# EasyEDA Pro project Bussiness_Card_Easyeda.epro

# Schematic Business Card
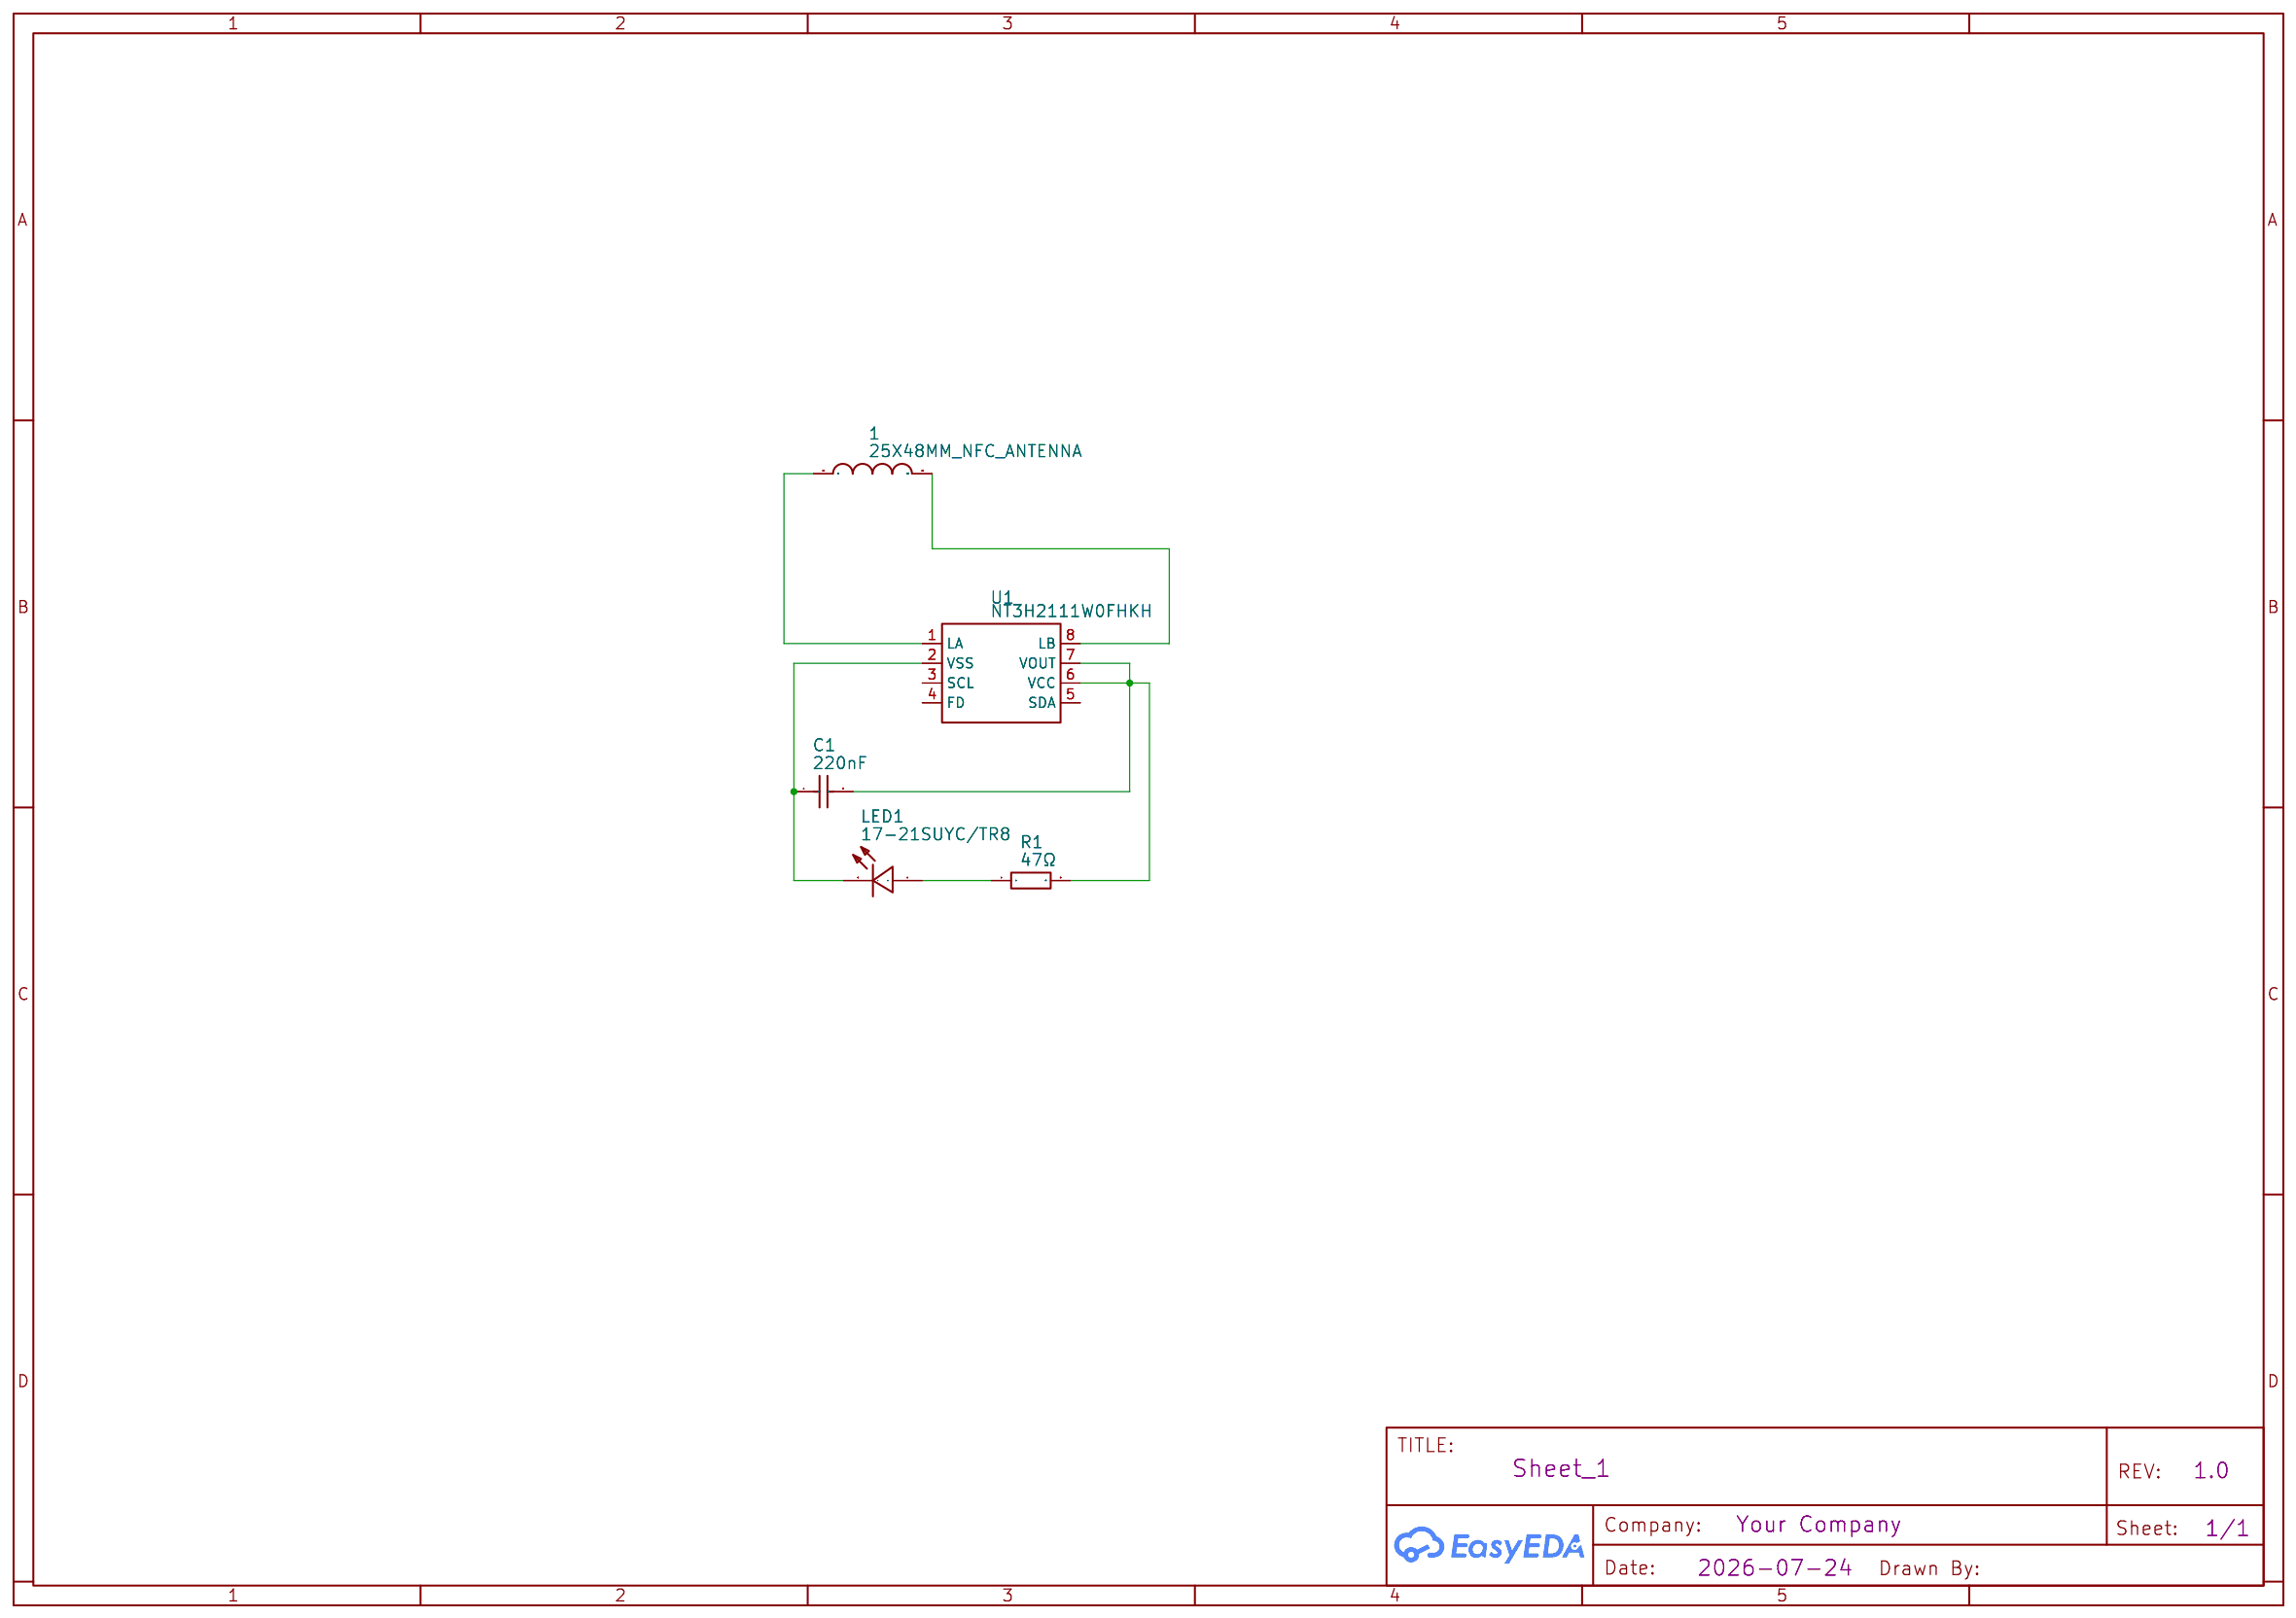
[diagram p0: schematic sheet]

## Parts
1  25X48MM_NFC_ANTENNA  [25X48MM_NFC_ANTENNA]
C1  220nF  [C0603]
LED1  17-21SUYC/TR8  [LED0805-R-RD]
R1  47Ω  [R0603]
U1  NT3H2111W0FHKH  [XQFN-8_L1.6-W1.6-P0.50-BL_NT3H2111W0FHKH]

## Library data of the parts
1 = 25X48MM_NFC_ANTENNA
C1 = CL10B224KA8NNNC: Supplier: LCSC; Manufacturer: SAMSUNG(三星); Supplier Part: C21120; JLCPCB Part Class: Basic Part; Origin 3D Model Title: C0603_L1.6-W0.8-H0.8
LED1 = KT-0805黄灯: Supplier: LCSC; Manufacturer: KENTO; Supplier Part: C2296; JLCPCB Part Class: Basic Part; Origin 3D Model Title: LED0805-RD
R1 = 0603WAF470JT5E: Supplier: LCSC; Manufacturer: UNI-ROYAL(厚声); Supplier Part: C23182; JLCPCB Part Class: Basic Part
U1 = NT3H2111W0FHKH: Supplier: LCSC; Supplier Part: C710403; Manufacturer: NXP(恩智浦); JLCPCB Part Class: Extended Part

## Nets
Net-(1-P$2): 1.P$2 U1.8(LB)
R1_1: LED1.1(+) R1.1
U1_1: 1.P$1 U1.1(LA)
U1_2: C1.1 LED1.2(-) U1.2(VSS)
U1_6: C1.2 R1.2 U1.6(VCC) U1.7(VOUT)

Not connected (* = marked no-connect by the designer): U1 3(SCL) 4(FD) 5(SDA)

# Board PCB_Business Card
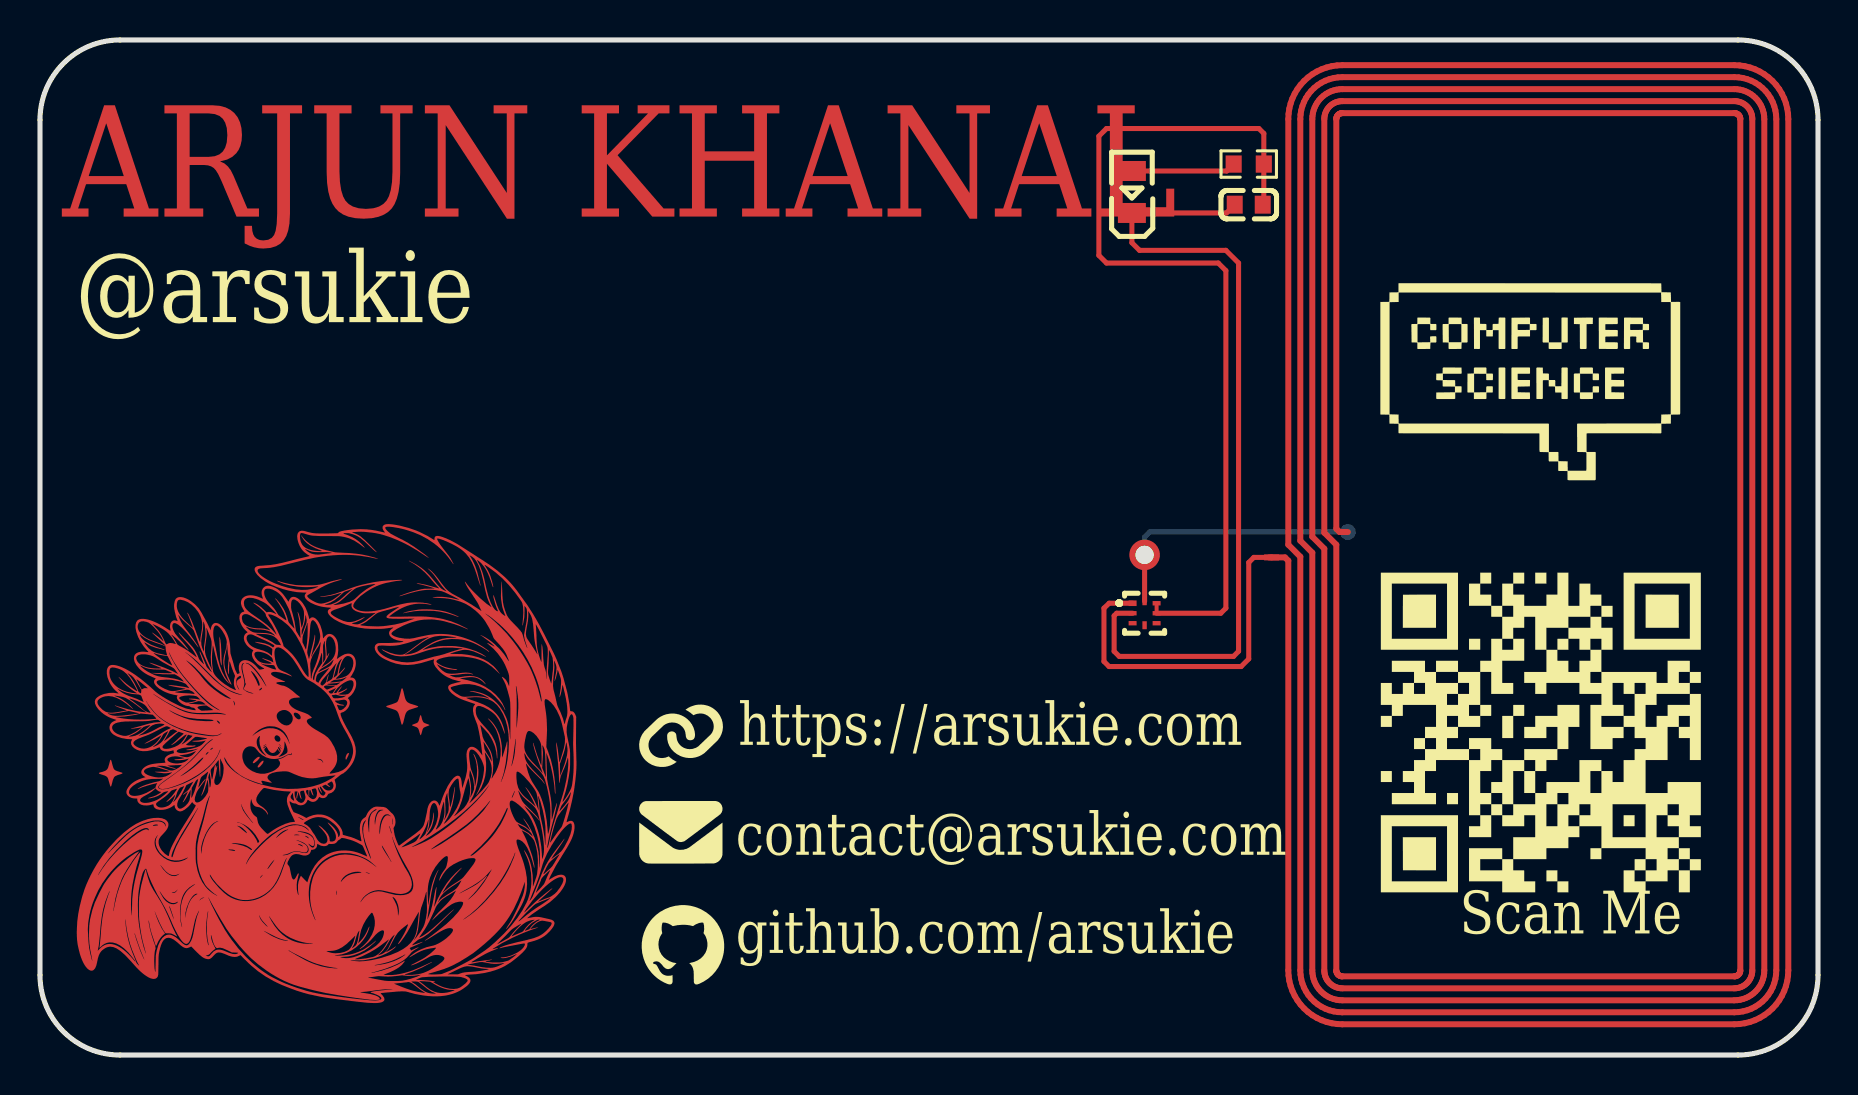
[diagram p1: board, top side]
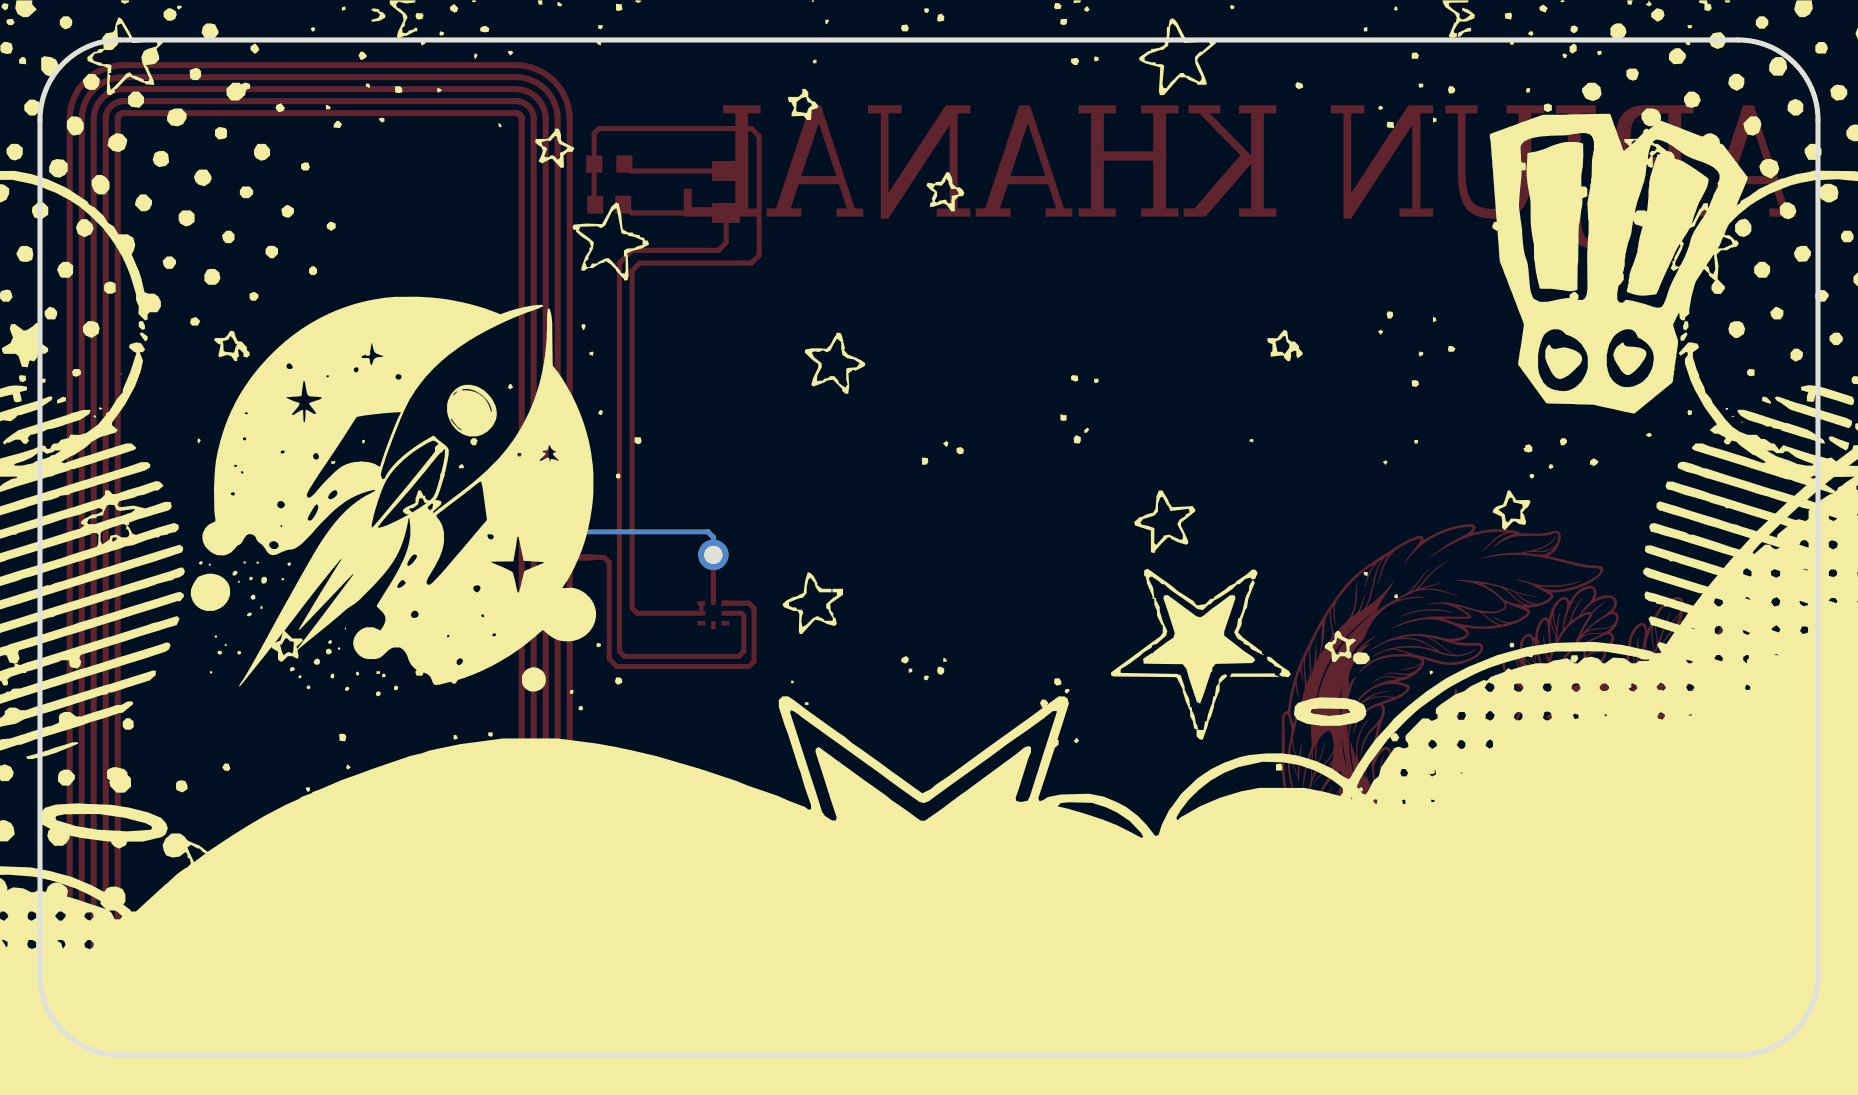
[diagram p2: board, bottom side, seen from below]

Outline 88.9 x 50.8 mm; copper layers: Top Layer, Bottom Layer. Coordinates in mm from the lower left corner of the outline.
Outline path: 0,46.8 arc(1.17,49.63) 4,50.8 84.9,50.8 arc(87.73,49.63) 88.9,46.8 88.9,4 arc(87.73,1.17) 84.9,0 4,0 arc(1.17,1.17) 0,4 0,46.8
Stack: Top Layer 0.035mm / Bottom Layer 0.035mm

## Design rules (mm)
spacing Default (default): track to track 0.102, other pairs 0 to 0.3
track width Default (default): min 0.254, default 0.254, max 25.4
differential pair differentialPair (default): width min 0.127, default 2.54, max 2.54; gap min 0.127, default 0.152

## Placement (name value [footprint] x y rotation side)
1  -  [25X48MM_NFC_ANTENNA]  74.91 25.54 90 top
C1  220nF  [C0603]  60.44 42.56 0 top
LED1  17-21SUYC/TR8  [LED0805-R-RD]  54.59 43.19 90 top
NOREF  -  [Pad_e107]  55.23 25.03 0 top
R1  47Ω  [R0603]  60.44 44.59 0 top
U1  NT3H2111W0FHKH  [XQFN-8_L1.6-W1.6-P0.50-BL_NT3H2111W0FHKH]  55.23 22.11 0 top

## Footprints (pads in the part's own frame, mm; a bottom-side part is the same pattern mirrored in y, then rotated)
25X48MM_NFC_ANTENNA
  rect 0.3x0.75 smd: P$1(-0.635,13.335)
  custom 0.792x0.8 smd far side: P$2(0.643,9.525)
C0603
  rect 0.8x0.9 smd: 1(-0.7,0) 2(0.7,0)
LED0805-R-RD
  rect 1x1.399 smd: 1(1.05,0) 2(-1.05,0)
Pad_e107
  round 1.524 hole 0.914: 1(0,0)
R0603
  rect 0.806x0.864 smd: 1(-0.753,0) 2(0.753,0)
XQFN-8_L1.6-W1.6-P0.50-BL_NT3H2111W0FHKH
  rect 0.4x0.28 smd: 1(-0.6,0.5)
  rect 0.4x0.22 smd: 2(-0.6,0) 3(-0.6,-0.5) 5(0.6,-0.5) 6(0.6,0) 7(0.6,0.5)
  rect 0.22x0.4 smd: 4(0,-0.6) 8(0,0.6)

## Nets
As in the schematic, except:
U1_8: 1.P$2 NOREF.1 U1.8

## Routing (per net, layer and track width the routed paths; a pad name or vN(x,y) marks a point on that pad's centre or on a via; arc(x,y) is an arc through that point)
R1_1: length 5.2
  Top Layer w0.254: LED1.1 59.34,44.24 R1.1
U1_1: length 17.8
  Top Layer w0.254: U1.1 53.46,22.61 53.2,22.36 53.2,19.7 53.45,19.44 60.06,19.44 60.44,19.82 60.44,24.65 60.69,24.9 1.P$1
U1_2: length 41.2
  Top Layer w0.254: C1.1 59.32,42.14 LED1.2 54.59,40.65 54.98,40.27 59.29,40.27 59.93,39.64 59.93,20.21 59.68,19.95 53.96,19.95 53.71,20.2 53.71,21.98 53.83,22.11 U1.2
U1_6: length 45.7
  Top Layer w0.2: U1.7 U1.6
  Top Layer w0.254: R1.2 61.19,42.61 C1.2 ; U1.6 59.04,22.11 59.29,22.36 59.29,39.25 58.91,39.64 53.32,39.64 52.94,40.02 52.94,45.99 53.32,46.37 60.94,46.37 61.19,46.12 61.19,44.59
U1_8: length 13.5
  Top Layer w0.254: U1.8 NOREF.1
  Bottom Layer w0.254: 1.P$2 55.49,26.18 55.23,25.92 NOREF.1

Small or netless copper shapes (teardrops, artwork), in the pictures only: 9 on Top Layer

## Text on the board
Top Layer: ARJUN KHANAL
Top Solder Mask Layer: ARJUN KHANAL
Top Silkscreen Layer: github.com/arsukie | https://arsukie.com | contact@arsukie.com | Scan Me | @arsukie
